# Altium schematic sheet CPU.SchDoc
size A4; SheetNumber: 3; SheetTotal: 4
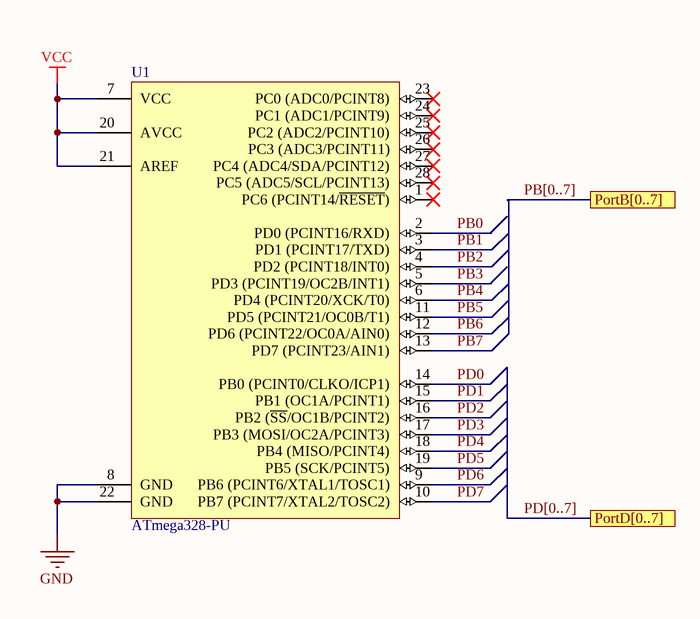
[diagram p0: CPU.SchDoc]

## Parts
U1  ATmega328-PU  [28P3]

## Ports
PortB[0..7], PortD[0..7]

## Nets
GND: U1.8(GND) U1.22(GND)
VCC: U1.7(VCC) U1.20(AVCC) U1.21(AREF)
PB0: U1.2(PD0_(PCINT16/RXD))
PB1: U1.3(PD1_(PCINT17/TXD))
PB2: U1.4(PD2_(PCINT18/INT0))
PB3: U1.5(PD3_(PCINT19/OC2B/INT1))
PB4: U1.6(PD4_(PCINT20/XCK/T0))
PB5: U1.11(PD5_(PCINT21/OC0B/T1))
PB6: U1.12(PD6_(PCINT22/OC0A/AIN0))
PB7: U1.13(PD7_(PCINT23/AIN1))
PD0: U1.14(PB0_(PCINT0/CLKO/ICP1))
PD1: U1.15(PB1_(OC1A/PCINT1))
PD2: U1.16(PB2_(~{SS}/OC1B/PCINT2))
PD3: U1.17(PB3_(MOSI/OC2A/PCINT3))
PD4: U1.18(PB4_(MISO/PCINT4))
PD5: U1.19(PB5_(SCK/PCINT5))
PD6: U1.9(PB6_(PCINT6/XTAL1/TOSC1))
PD7: U1.10(PB7_(PCINT7/XTAL2/TOSC2))

Not connected (* = marked no-connect by the designer): U1 1(PC6_(PCINT14/~{RESET}))* 23(PC0_(ADC0/PCINT8))* 24(PC1_(ADC1/PCINT9))* 25(PC2_(ADC2/PCINT10))* 26(PC3_(ADC3/PCINT11))* 27(PC4_(ADC4/SDA/PCINT12))* 28(PC5_(ADC5/SCL/PCINT13))*

## Buses and harness runs
bus PB[0..7] = port PortB[0..7]
bus PD[0..7] = port PortD[0..7]

## Library data of the parts
U1 = CMP-0095-00015-2: 8-bit AVR Microcontroller, 32KB Flash, 1KB EEPROM, 2KB SRAM, 28-pin PDIP, Industrial Grade (-40°C to 85°C); ComponentLink3Description: ATmega48A/48PA/88A/88PA/168A/168PA/328/328P Summary; RevisionNote: DatasheetVersion updated. URLs added.; DatasheetVersion: revD, May-2011; ComponentLink1URL: http://www.atmel.com/; PackageVersion: revB, Sep-2001; PackageDescription: 28-lead (0.300"/7.62mm Wide) Plastic Dual Inline Package (PDIP); PackageReference: 28P3; ComponentLink1Description: Manufacturer URL; ComponentLink2Description: ATmega48A/48PA/88A/88PA/168A/168PA/328/328P Datasheet; ComponentLink3URL: http://www.atmel.com/dyn/resources/prod_documents/8271S.pdf; ComponentLink2URL: http://www.atmel.com/dyn/resources/prod_documents/8271.pdf